# Altium schematic sheet CNC_shield_for_mkr1000_Sch.SchDoc
size A4
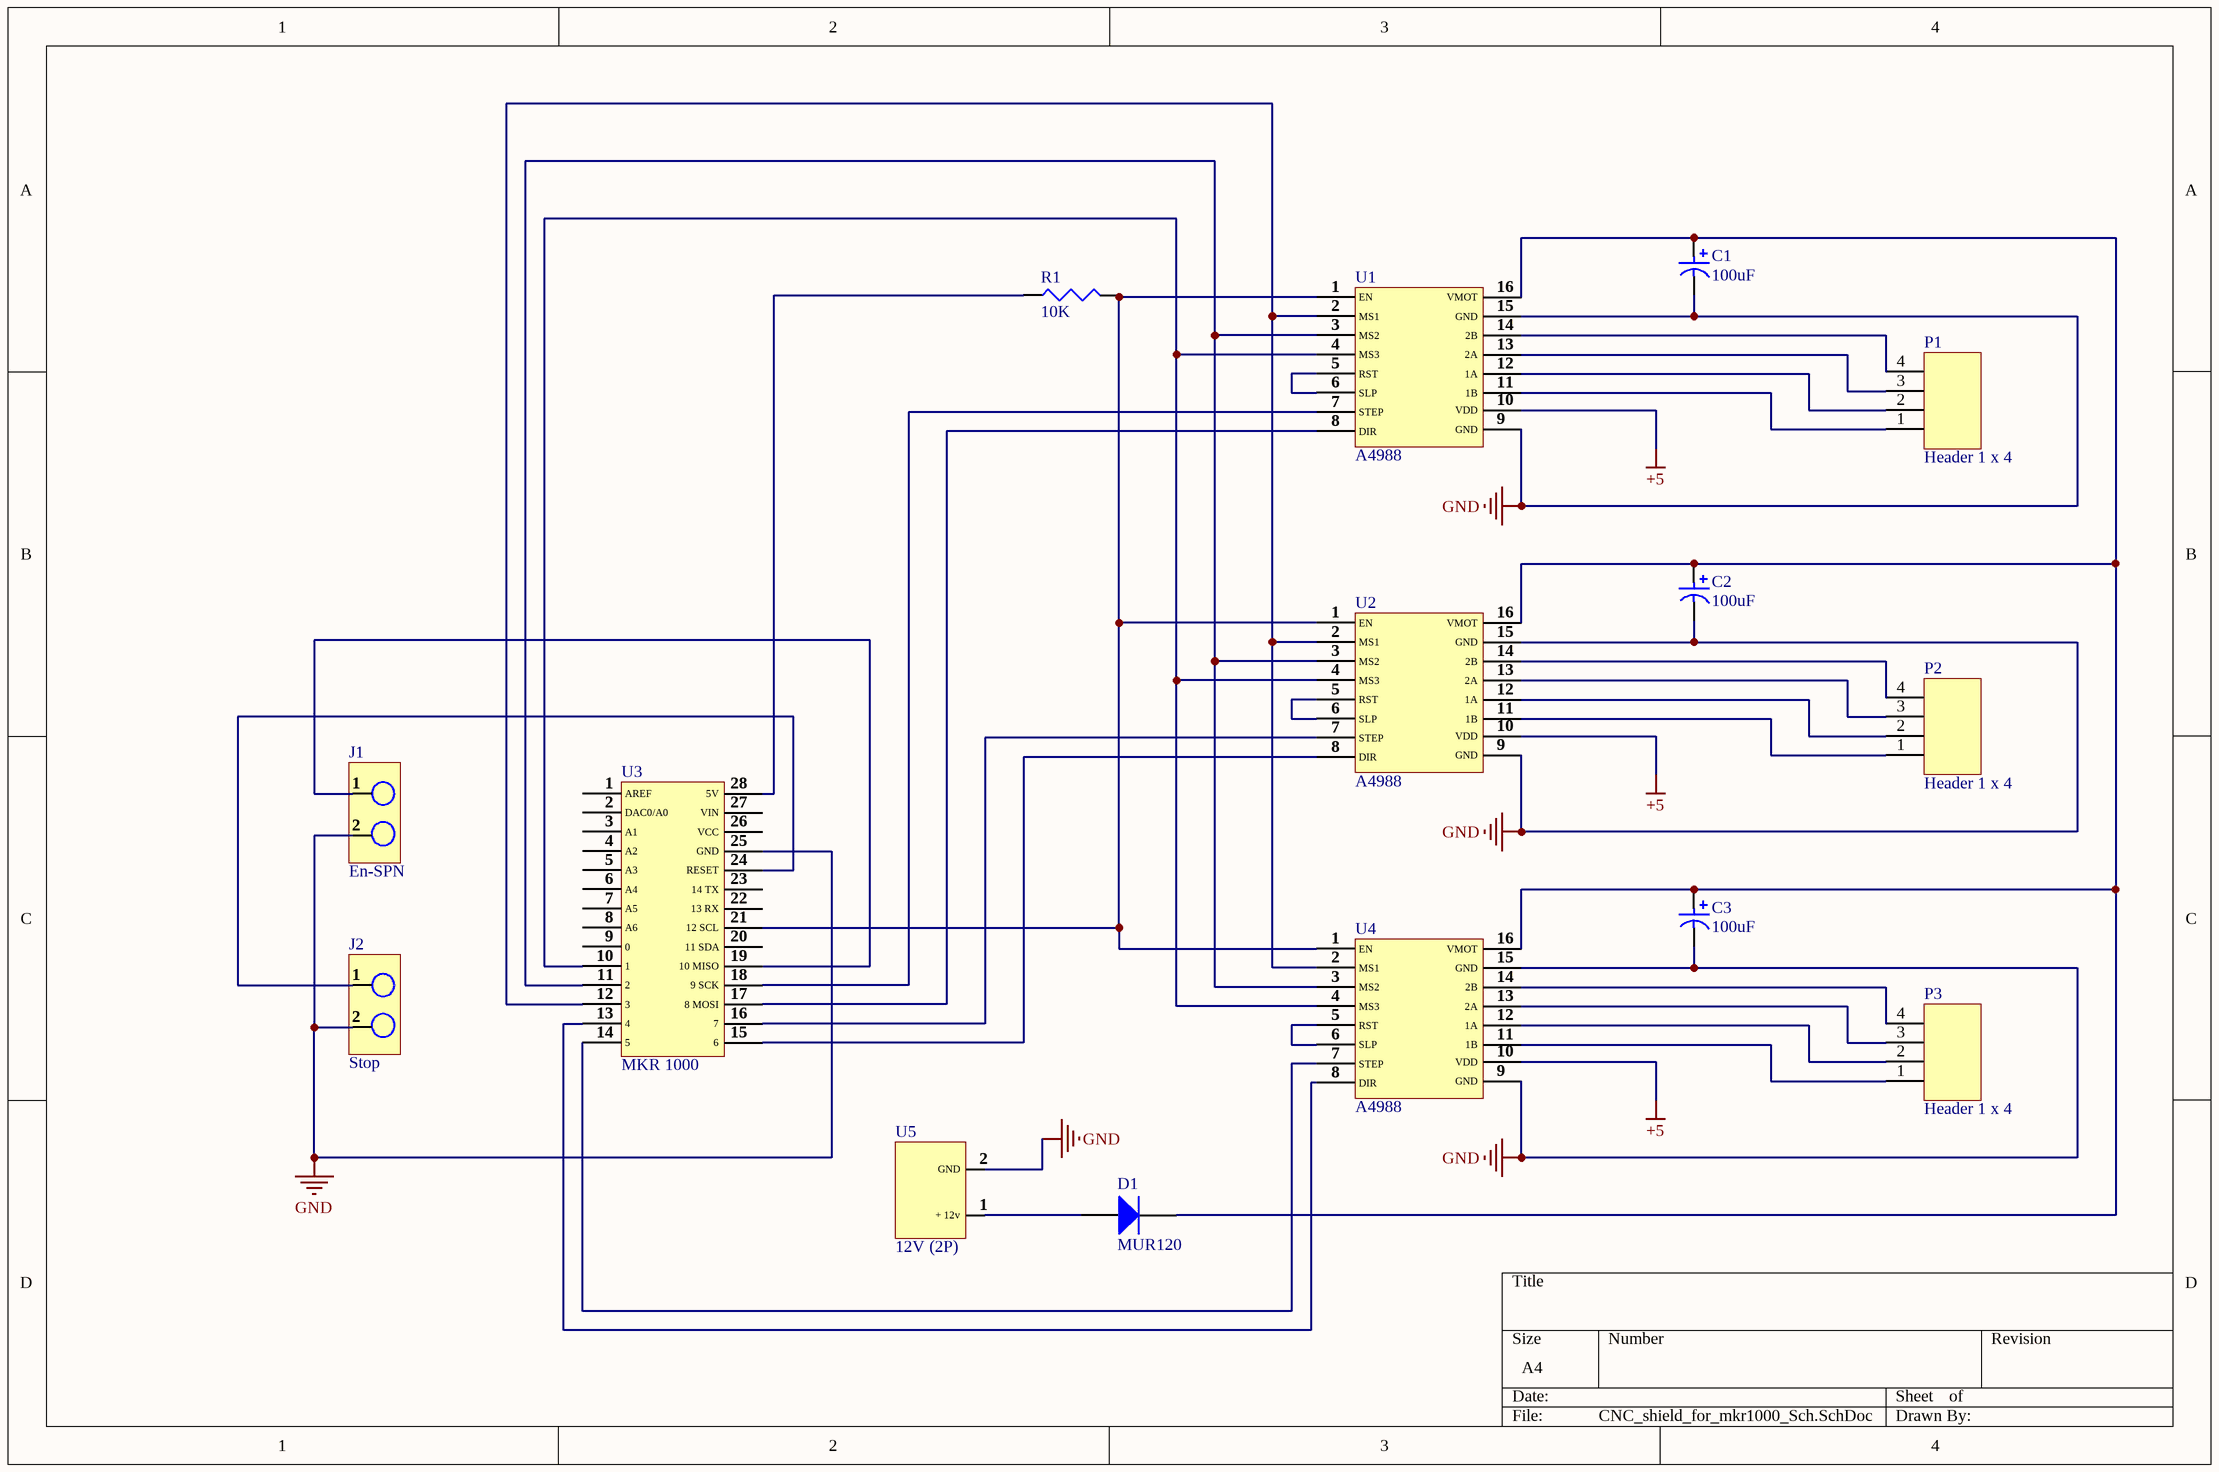
[diagram p0: CNC_shield_for_mkr1000_Sch.SchDoc]

## Parts
C1  100uF  [CAP-D8.0XF3.5]
C2  100uF  [CAP-D8.0XF3.5]
C3  100uF  [CAP-D8.0XF3.5]
D1  MUR120  [DO-41]
J1  En-SPN  [M1X2]
J2  Stop  [M1X2]
P1  Header 1 x 4  [HDR1X4]
P2  Header 1 x 4  [HDR1X4]
P3  Header 1 x 4  [HDR1X4]
R1  10K  [AXIAL-0.4]
U1  A4988  [A4988 Stepper Motor Driver Carrier]
U2  A4988  [A4988 Stepper Motor Driver Carrier]
U3  MKR 1000  [MKR 1000]
U4  A4988  [A4988 Stepper Motor Driver Carrier]
U5  12V (2P)  [BORNERA 2 PINES]

## Nets
+5: U1.10(VDD) U2.10(VDD) U4.10(VDD)
GND: C1.2 C2.2 C3.2 J1.2 J2.2 U1.9(GND) U1.15(GND) U2.9(GND) U2.15(GND) U3.25(GND) U4.9(GND) U4.15(GND) U5.2(GND)
NetC1_1: C1.1 C2.1 C3.1 D1.2(K) U1.16(VMOT) U2.16(VMOT) U4.16(VMOT)
NetD1_1: D1.1(A) U5.1(+_12v)
NetJ1_1: J1.1(EN) U3.19(10_MISO)
NetJ2_1: J2.1(EN) U3.24(RESET)
NetP1_1: P1.1 U1.11(1B)
NetP1_2: P1.2 U1.12(1A)
NetP1_3: P1.3 U1.13(2A)
NetP1_4: P1.4 U1.14(2B)
NetP2_1: P2.1 U2.11(1B)
NetP2_2: P2.2 U2.12(1A)
NetP2_3: P2.3 U2.13(2A)
NetP2_4: P2.4 U2.14(2B)
NetP3_1: P3.1 U4.11(1B)
NetP3_2: P3.2 U4.12(1A)
NetP3_3: P3.3 U4.13(2A)
NetP3_4: P3.4 U4.14(2B)
NetR1_1: R1.1 U3.28(5V)
NetR1_2: R1.2 U1.1(EN) U2.1(EN) U3.21(12_SCL) U4.1(EN)
NetU1_2: U1.2(MS1) U2.2(MS1) U3.12(3) U4.2(MS1)
NetU1_3: U1.3(MS2) U2.3(MS2) U3.11(2) U4.3(MS2)
NetU1_4: U1.4(MS3) U2.4(MS3) U3.10(1) U4.4(MS3)
NetU1_5: U1.5(RST) U1.6(SLP)
NetU1_7: U1.7(STEP) U3.18(9_SCK)
NetU1_8: U1.8(DIR) U3.17(8_MOSI)
NetU2_5: U2.5(RST) U2.6(SLP)
NetU2_7: U2.7(STEP) U3.16(7)
NetU2_8: U2.8(DIR) U3.15(6)
NetU3_13: U3.13(4) U4.8(DIR)
NetU3_14: U3.14(5) U4.7(STEP)
NetU4_5: U4.5(RST) U4.6(SLP)

Not connected (* = marked no-connect by the designer): U3 1(AREF) 2(DAC0/A0) 3(A1) 4(A2) 5(A3) 6(A4) 7(A5) 8(A6) 9(0) 20(11_SDA) 22(13_RX) 23(14_TX) 26(VCC) 27(VIN)

## Library data of the parts
C1-C3 = Cap Pol3: Polarized Capacitor (Surface Mount); Published: 8-Jun-2000; LatestRevisionDate: 29-May-2009; LatestRevisionNote: IPC-7351 Footprint Added.; PackageReference: C0805; Publisher: Altium Limited; PackageDescription: Chip Capacitor
D1 = MUR120: Diode; Published: 8-Jun-2000; LatestRevisionDate: 17-Jul-2002; LatestRevisionNote: Re-released for DXP Platform.; PackageVersion: Sep-1996; PackageReference: SMC; Publisher: Altium Limited; PackageDescription: DO-214-AB/SMC; 2 C-Bend Leads; Body 7.9 x 5.9 mm, inc. leads (LxW); Code_JEDEC: DO-214-AB
J1 = En-SPN: Jumper
J2 = Stop: Jumper
P1-P3 = Header 1 x 4: Header, 4-Pin; LatestRevisionDate: 17-Jul-2002; LatestRevisionNote: Re-released for DXP Platform.; Publisher: Altium Limited
R1 = 10K: Resistor; Published: 8-Jun-2000; LatestRevisionDate: 29-May-2009; LatestRevisionNote: IPC-7351 Footprint Added.; PackageReference: J1-0603; Publisher: Altium Limited; PackageDescription: Chip Resistor
U1 U2 U4 = A4988: Motor Driver
U3 = Arduino MKR 1000: Arduino wifi
U5 = 12V (2P): IC